# Altium schematic sheet Automotive Connector.SchDoc
size A4
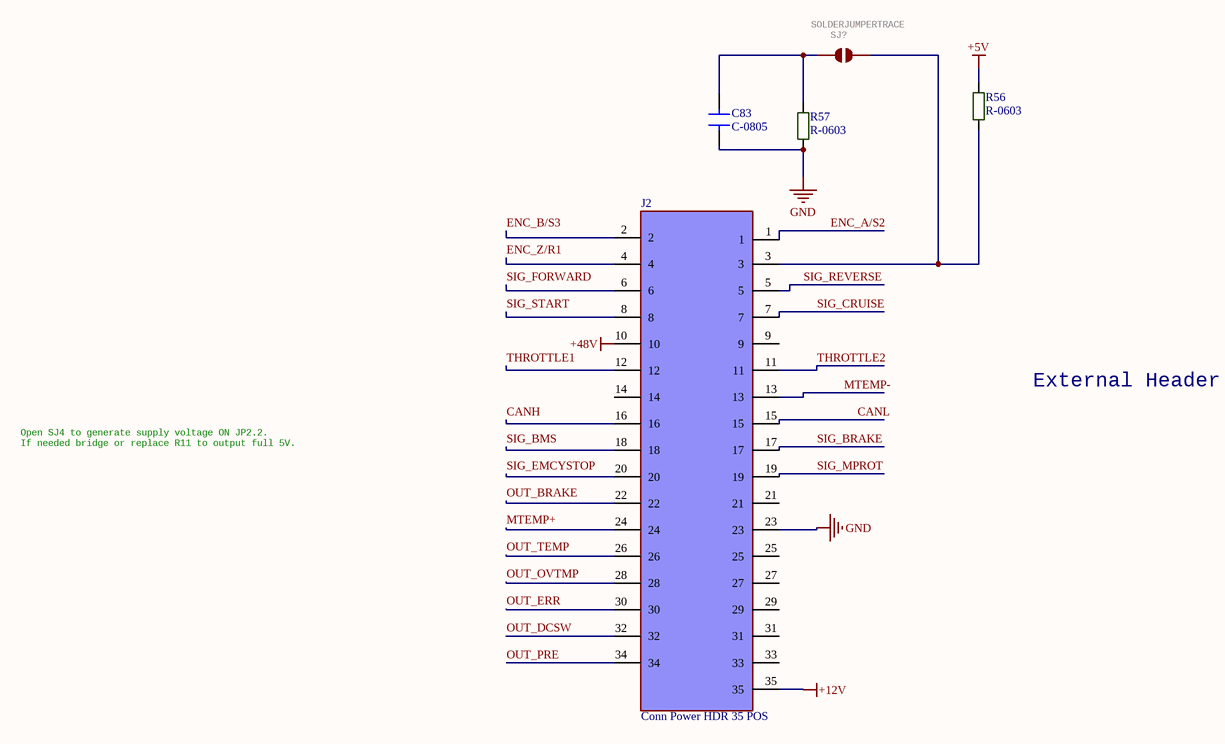
[diagram p0: Automotive Connector.SchDoc]

## Parts
C83  C-0805  [C-0805]
J2  Conn Power HDR 35 POS  [TE_776230-2]
R56  R-0603  [R-0603R]
R57  R-0603  [R-0603R]
SJ?  SOLDERJUMPERTRACE  [SJ_2S-TRACE]

## Nets
+5V: R56.2
+12V: J2.35
+48V: J2.10
GND: C83.1 J2.23 R57.1
CANH: J2.16
CANL: J2.15
ENC_A/S2: J2.1
ENC_B/S3: J2.2
ENC_Z/R1: J2.4
MTEMP+: J2.24
MTEMP-: J2.13
OUT_BRAKE: J2.22
OUT_DCSW: J2.32
OUT_ERR: J2.30
OUT_OVTMP: J2.28
OUT_PRE: J2.34
OUT_TEMP: J2.26
SIG_BMS: J2.18
SIG_BRAKE: J2.17
SIG_CRUISE: J2.7
SIG_EMCYSTOP: J2.20
SIG_FORWARD: J2.6
SIG_MPROT: J2.19
SIG_REVERSE: J2.5
SIG_START: J2.8
THROTTLE1: J2.12
THROTTLE2: J2.11
NetC83_2: C83.2 R57.2 SJ?.1
NetJ2_3: J2.3 R56.1 SJ?.2

Not connected (* = marked no-connect by the designer): J2 9 14 21 25 27 29 31 33

## Notes on the sheet
- External Header
- Open SJ4 to generate supply voltage ON JP2.2.
  If needed bridge or replace R11 to output full 5V.

## Library data of the parts
J2 = Conn Power HDR 35 POS: Conn Power HDR 35 POS 4mm Solder ST Thru-Hole 35 Terminal 1 Port Automotive Loose; MP: 776230-2; MF: TE Connectivity; Package: None; EU_RoHS_Compliance: Compliant; DigiKey-Purchase-URL: https://snapeda.com/shop?store=DigiKey&id=1466385; Value: *; Availability: Unavailable; Price: None; SnapEDA_Link: https://www.snapeda.com/parts/776230-2/TE%20Connectivity%20AMP%20Connectors/view-part/1466385/?ref=snap
SJ? = SOLDERJUMPERTRACE: Solder JumperStandard SMD solder jumper. Used to automate production. Two varients : Normally Open and Normally Closed are the same, but have different paste layers. NC will have a large amount of paste and should jumper during reflow.; GateName_1: 1; SymbolName_1: SJ; DeviceName: TRACE; LibraryName: SparkFun-Passives; DeviceSetName: SOLDERJUMPER